# Altium schematic sheet OmapSystem.SchDoc
size A4
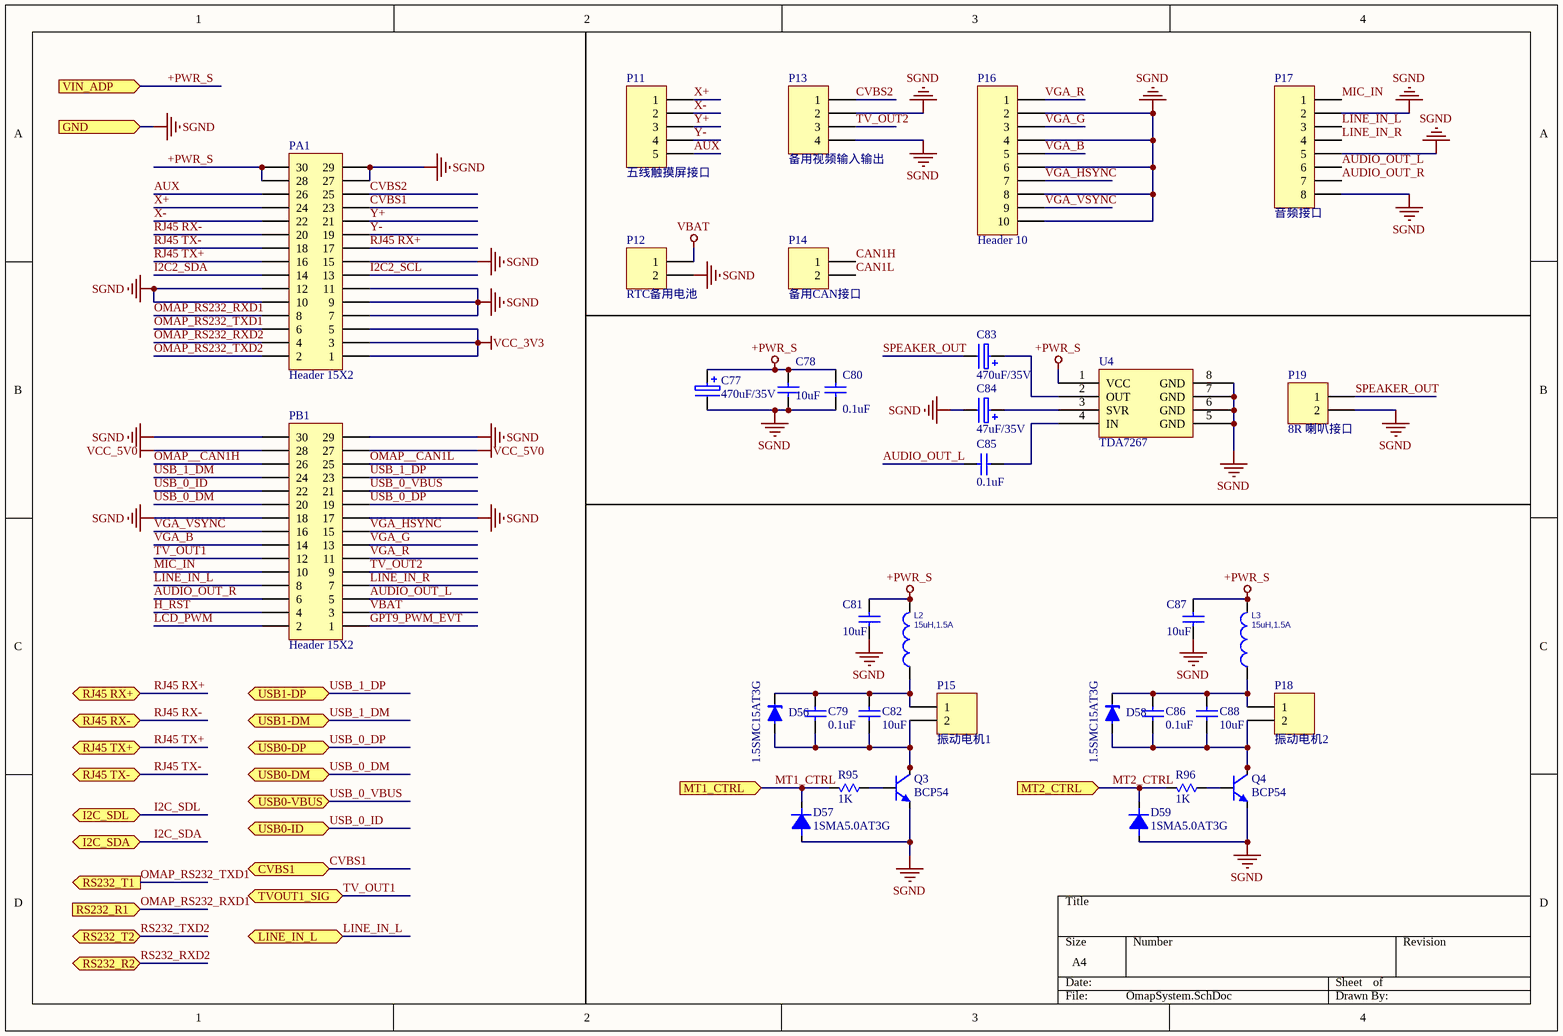
[diagram p0: OmapSystem.SchDoc]

## Parts
C77  470uF/35V  [CT7343-E]
C78  10uF  [C1206]
C79  0.1uF  [C0805]
C80  0.1uF  [C0805]
C81  10uF  [C1206]
C82  10uF  [C1206]
C83  470uF/35V  [CT7343-E]
C84  47uF/35V  [CT7343-D]
C85  0.1uF  [C0805]
C86  0.1uF  [C0805]
C87  10uF  [C1206]
C88  10uF  [C1206]
D56  1.5SMC15AT3G  [SMC]
D57  1SMA5.0AT3G  [SMA]
D58  1.5SMC15AT3G  [SMC]
D59  1SMA5.0AT3G  [SMA]
L2  15uH,1.5A  [L3030-P]
L3  15uH,1.5A  [L3030-P]
P11  五线触摸屏接口  [DS1X5-2.54]
P12  RTC备用电池  [CR2428]
P13  备用视频输入输出  [DS1X4-2.54]
P14  备用CAN接口  [DS1X2-2.54]
P15  振动电机1  [1MM25_2PIN_SMT_R90]
P16  Header 10  [DS1X10-2.54]
P17  音频接口  [DS1X8-2.54]
P18  振动电机2  [1MM25_2PIN_SMT_R90]
P19  8R 喇叭接口  [DS1X2-2.54]
PA1  Header 15X2  [HDR2X15]
PB1  Header 15X2  [HDR2X15]
Q3  BCP54  [SOT-223]
Q4  BCP54  [SOT-223]
R95  1K  [R0805]
R96  1K  [R0805]
U4  TDA7267  [DIP8]

## Ports
CVBS1 (bidir), GND (in), I2C_SDA (bidir), I2C_SDL (bidir), LINE_IN_L (bidir), MT1_CTRL (in), MT2_CTRL (in), RJ45 RX+ (bidir), RJ45 RX- (bidir), RJ45 TX+ (bidir), RJ45 TX- (bidir), RS232_R1 (in), RS232_R2 (bidir), RS232_T1 (out), RS232_T2 (bidir), TVOUT1_SIG (bidir), USB0-DM (bidir), USB0-DP (bidir), USB0-ID (bidir), USB0-VBUS (bidir), USB1-DM (bidir), USB1-DP (bidir), VIN_ADP (in)

## Nets
+PWR_S: C77.1 C78.2 C80.2 C81.2 C87.2 L2.2 L3.2 PA1.28 PA1.30 U4.1(VCC) ; port VIN_ADP
SGND: C77.2 C78.1 C80.1 C81.1 C84.2 C87.1 D57.1(A) D59.1(A) P12.2 P13.2 P13.4 P16.2 P16.4 P16.6 P16.8 P16.10 P17.2 P17.5 P17.8 P19.2 PA1.7 PA1.9 PA1.10 PA1.11 PA1.12 PA1.15 PA1.27 PA1.29 PB1.17 PB1.18 PB1.29 PB1.30 Q3.3(E) Q4.3(E) U4.5(GND) U4.6(GND) U4.7(GND) U4.8(GND) ; port GND
VBAT: P12.1 PB1.3
VCC_3V3: PA1.1 PA1.3 PA1.5
VCC_5V0: PB1.27 PB1.28
AUDIO_OUT_L: C85.1 P17.6 PB1.5
AUDIO_OUT_R: P17.7 PB1.6
AUX: P11.5 PA1.26
CAN1H: P14.1
CAN1L: P14.2
CVBS1: PA1.23 ; port CVBS1
CVBS2: P13.1 PA1.25
GPT9_PWM_EVT: PB1.1
H_RST: PB1.4
I2C2_SCL: PA1.13
I2C2_SDA: PA1.14
I2C_SDA: port I2C_SDA
I2C_SDL: port I2C_SDL
LCD_PWM: PB1.2
LINE_IN_L: P17.3 PB1.8 ; port LINE_IN_L
LINE_IN_R: P17.4 PB1.7
MIC_IN: P17.1 PB1.10
MT1_CTRL: D57.2(K) R95.2 ; port MT1_CTRL
MT2_CTRL: D59.2(K) R96.2 ; port MT2_CTRL
OMAP__CAN1H: PB1.26
OMAP__CAN1L: PB1.25
OMAP_RS232_RXD1: PA1.8 ; port RS232_R1
OMAP_RS232_RXD2: PA1.4
OMAP_RS232_TXD1: PA1.6 ; port RS232_T1
OMAP_RS232_TXD2: PA1.2
RJ45 RX+: PA1.17 ; port RJ45 RX+
RJ45 RX-: PA1.20 ; port RJ45 RX-
RJ45 TX+: PA1.16 ; port RJ45 TX+
RJ45 TX-: PA1.18 ; port RJ45 TX-
RS232_RXD2: port RS232_R2
RS232_TXD2: port RS232_T2
SPEAKER_OUT: C83.2 P19.1
TV_OUT1: PB1.12 ; port TVOUT1_SIG
TV_OUT2: P13.3 PB1.9
USB_0_DM: PB1.20 ; port USB0-DM
USB_0_DP: PB1.19 ; port USB0-DP
USB_0_ID: PB1.22 ; port USB0-ID
USB_0_VBUS: PB1.21 ; port USB0-VBUS
USB_1_DM: PB1.24 ; port USB1-DM
USB_1_DP: PB1.23 ; port USB1-DP
VGA_B: P16.5 PB1.14
VGA_G: P16.3 PB1.13
VGA_HSYNC: P16.7 PB1.15
VGA_R: P16.1 PB1.11
VGA_VSYNC: P16.9 PB1.16
X+: P11.1 PA1.24
X-: P11.2 PA1.22
Y+: P11.3 PA1.21
Y-: P11.4 PA1.19
NetC79_1: C79.1 C82.2 D56.1(A) P15.2 Q3.2(C) Q3.4(C)
NetC79_2: C79.2 C82.1 D56.2(K) L2.1 P15.1
NetC83_1: C83.1 U4.2(OUT)
NetC84_1: C84.1 U4.3(SVR)
NetC85_2: C85.2 U4.4(IN)
NetC86_1: C86.1 C88.2 D58.1(A) P18.2 Q4.2(C) Q4.4(C)
NetC86_2: C86.2 C88.1 D58.2(K) L3.1 P18.1
NetQ3_1: Q3.1(B) R95.1
NetQ4_1: Q4.1(B) R96.1

## Library data of the parts
C77 C83 C84 = ELECTRO: Electrolytic Capacitor
C78 C80-C82 C87 C88 = CAP: Published: 8-Jun-2000; LatestRevisionDate: 17-Jul-2002; LatestRevisionNote: Re-released for DXP Platform.; PackageReference: RAD-0.3; Publisher: Altium Limited
  C78 C81 C82 C87 C88: Value: 10uF
  C80: Value: 0.1uF
C79 C85 C86 = Cap: Capacitor; Published: 8-Jun-2000; Revision: July-2002: Re-released for DXP Platform.; Publisher: Altium Limited; Value: 0.1uF
D56 D58 = DIODE-ZENER: Small Signal Zener Diodes
D57 D59 = DIODE1: Diode
L2 L3 = Inductor: Code_IEC: 1005; Value: 10mH; Published: 8-Jun-2000; LatestRevisionDate: 29-May-2009; LatestRevisionNote: IPC-7351 Footprint Added.; PackageReference: 0402-A; Publisher: Altium Limited; PackageDescription: Chip Inductor; Code_JEITA: 0402
P11 = Header 5: Header, 5-Pin; LatestRevisionDate: 17-Jul-2002; LatestRevisionNote: Re-released for DXP Platform.; Publisher: Altium Limited
P12 P14 P15 P18 P19 = Header 2: Header, 2-Pin; LatestRevisionDate: 17-Jul-2002; LatestRevisionNote: Re-released for DXP Platform.; Publisher: Altium Limited
P13 = Header 4: Header, 4-Pin; LatestRevisionDate: 17-Jul-2002; LatestRevisionNote: Re-released for DXP Platform.; Publisher: Altium Limited
P16 = Header 10: Header, 10-Pin; LatestRevisionDate: 17-Jul-2002; LatestRevisionNote: Re-released for DXP Platform.; Publisher: Altium Limited
P17 = Header 8: Header, 8-Pin; LatestRevisionDate: 17-Jul-2002; LatestRevisionNote: Re-released for DXP Platform.; Publisher: Altium Limited
PA1 PB1 = Header 15X2: Header, 15-Pin, Dual row; LatestRevisionDate: 17-Jul-2002; LatestRevisionNote: Re-released for DXP Platform.; Publisher: Altium Limited
R95 R96 = RES: Resistor; Published: 8-Jun-2000; LatestRevisionDate: 17-Jul-2002; LatestRevisionNote: Re-released for DXP Platform.; PackageReference: AXIAL-0.3; Publisher: Altium Limited; Value: 1K
U4 = TDA7267: 2W功放芯片
Q3 Q4 = BCP54: Published: 8-Jun-2000; LatestRevisionDate: 15-Jan-2003; LatestRevisionNote: PCB Footprint 'BCY-W3/D4.7' replaced; DatasheetDocument: 1997; PackageDocument: Sep-1998; PackageReference: TO-92A; Publisher: Altium Limited; Code_JEDEC: TO-92A; ComponentLink1Description: Manufacturer Link; ComponentLink1URL: http://www.fairchildsemi.com/; ComponentLink2Description: Datasheet; ComponentLink2URL: http://www.fairchildsemi.com/ds/2N%2F2N3904.pdf